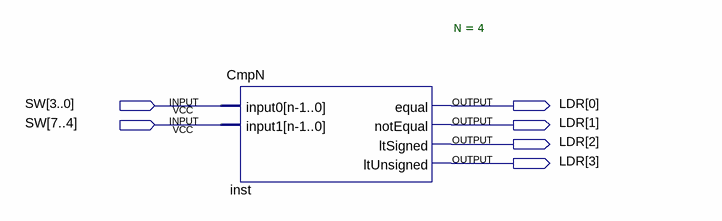
[diagram p0: schematic sheet]
// Quartus schematic CmpN_Demo.bdf as structural Verilog: 1 symbols, 6 pins
module CmpN_Demo (
  input  [7:0] SW,
  output [3:0] LDR
);

  CmpN #(.N(4)) inst (
    .input0(SW[3:0]), .input1(SW[7:4]), .equal(LDR[0]), .notEqual(LDR[1]), .ltSigned(LDR[2]),
    .ltUnsigned(LDR[3]));
endmodule
